# Altium schematic sheet 09-UART.SchDoc
size A4
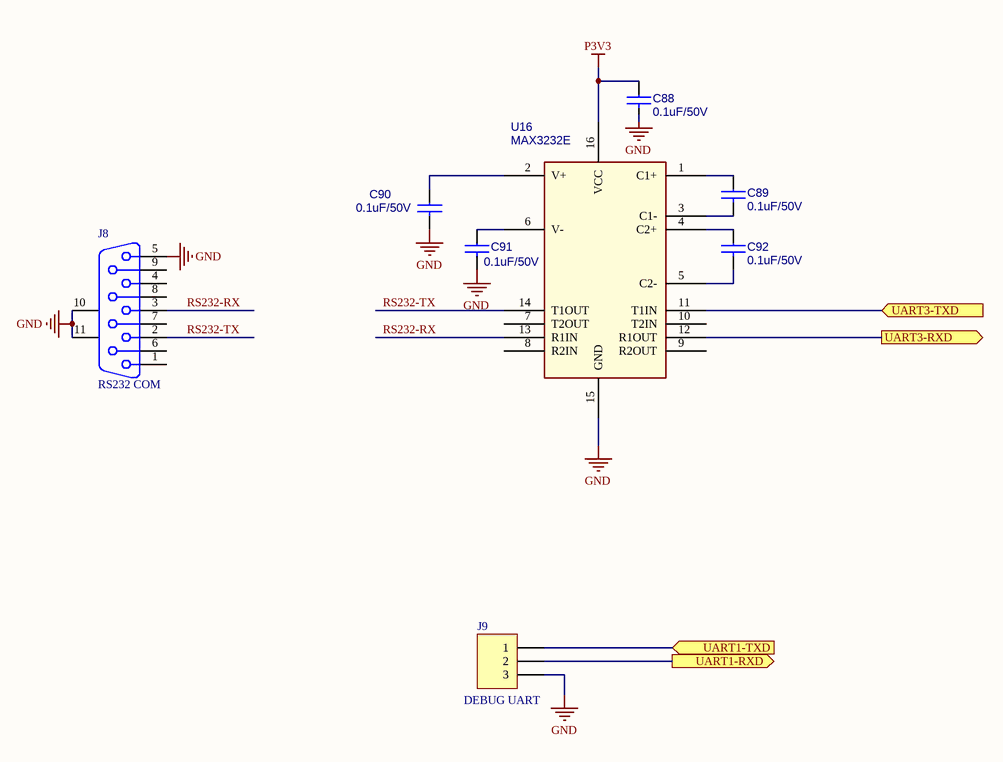
[diagram p0: 09-UART.SchDoc]

## Parts
C88  0.1uF/50V  [0402]
C89  0.1uF/50V  [0402]
C90  0.1uF/50V  [0402]
C91  0.1uF/50V  [0402]
C92  0.1uF/50V  [0402]
J8  RS232 COM  [DB9-F]
J9  DEBUG UART  [HDR1X3]
U16  MAX3232E  [SO-16]

## Ports
UART1-RXD (out), UART1-TXD (in), UART3-RXD (out), UART3-TXD (in)

## Nets
GND: C88.2 C90.2 C91.2 J8.5 J8.10(MH1) J8.11(MH2) J9.3 U16.15(GND)
P3V3: C88.1 U16.16(VCC)
RS232-RX: J8.3 U16.13(R1IN)
RS232-TX: J8.2 U16.14(T1OUT)
UART1-RXD: J9.2 ; port UART1-RXD
UART1-TXD: J9.1 ; port UART1-TXD
UART3-RXD: U16.12(R1OUT) ; port UART3-RXD
UART3-TXD: U16.11(T1IN) ; port UART3-TXD
NetC89_1: C89.1 U16.1(C1+)
NetC89_2: C89.2 U16.3(C1-)
NetC90_1: C90.1 U16.2(V+)
NetC91_1: C91.1 U16.6(V-)
NetC92_1: C92.1 U16.4(C2+)
NetC92_2: C92.2 U16.5(C2-)

Not connected (* = marked no-connect by the designer): J8 1 4 6 7 8 9; U16 7(T2OUT) 8(R2IN) 9(R2OUT) 10(T2IN)

## Library data of the parts
C88-C92 = CAP
J8 = D Connector 9: Receptacle Assembly, 9 Position, Right Angle; PackageDocument: O; Positions: 9; Published: 15-Jun-2001; LatestRevisionDate: 17-Jul-2002; LatestRevisionNote: Re-released for DXP Platform.; DatasheetDocument: 1-Sep-1999; PackageReference: 788750; Publisher: Altium Limited; Orientation: Right Angle; Gender: Receptacle
J9 = Header 3: Header, 3-Pin; LatestRevisionDate: 17-Jul-2002; LatestRevisionNote: Re-released for DXP Platform.; Publisher: Altium Limited
U16 = MAX3232